# Altium schematic sheet Controller.SchDoc
size A3
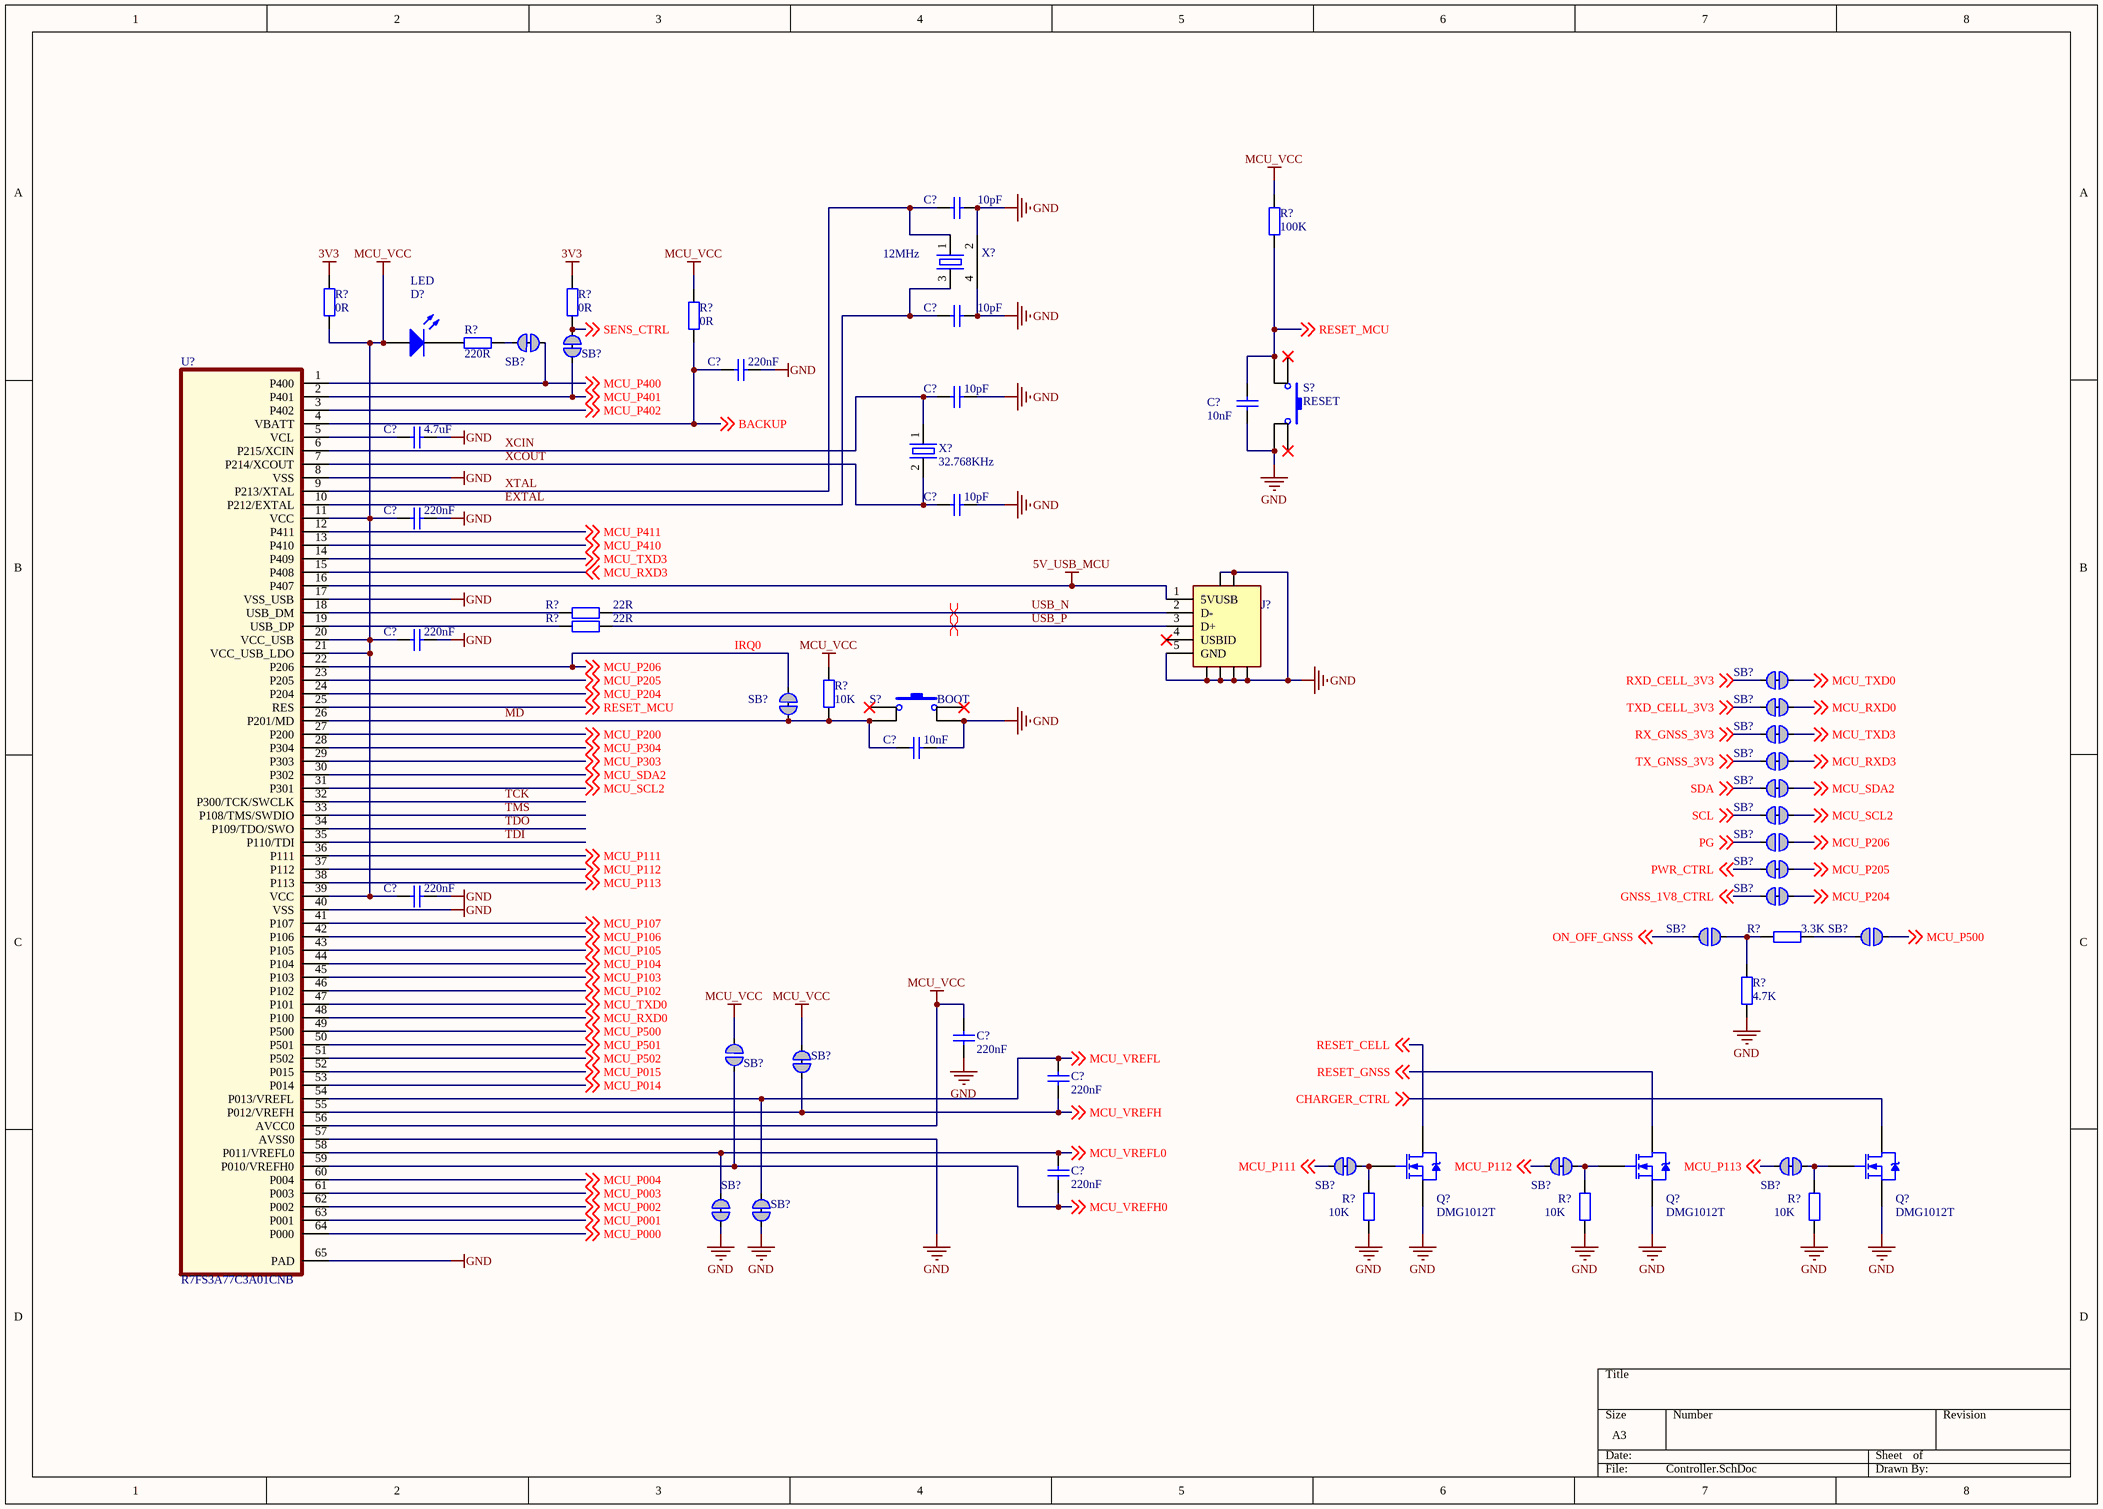
[diagram p0: Controller.SchDoc]

## Parts
(Parts that share a designator on the sheet are numbered #1, #2 ... from top to bottom, then left to right.)
C?#1  value 10pF  [C0402]  (hidden comment: Cap Semi)
C?#2  value 10pF  [C0402]  (hidden comment: Cap Semi)
C?#3  value 220nF  [C0402]  (hidden comment: Cap Semi)
C?#4  value 10pF  [C0402]  (hidden comment: Cap Semi)
C?#5  value 10nF  [C0402]  (hidden comment: Cap Semi)
C?#6  value 4.7uF  [C0402]  (hidden comment: Cap Semi)
C?#7  value 10pF  [C0402]  (hidden comment: Cap Semi)
C?#8  value 220nF  [C0402]  (hidden comment: Cap Semi)
C?#9  value 220nF  [C0402]  (hidden comment: Cap Semi)
C?#10  value 10nF  [C0402]  (hidden comment: Cap Semi)
C?#11  value 220nF  [C0402]  (hidden comment: Cap Semi)
C?#12  value 220nF  [C0402]  (hidden comment: Cap Semi)
C?#13  value 220nF  [C0402]  (hidden comment: Cap Semi)
C?#14  value 220nF  [C0402]  (hidden comment: Cap Semi)
D?  LED  [LED0805]
J?  CON-000116-01  [10103594_micro_USB]  (value not drawn)
Q?#1  DMG1012T  [SOT-523_custom]
Q?#2  DMG1012T  [SOT-523_custom]
Q?#3  DMG1012T  [SOT-523_custom]
R?#1  value 100K  [R0402]  (hidden comment: Res2)
R?#2  value 0R  [R0402]  (hidden comment: Res2)
R?#3  value 0R  [R0402]  (hidden comment: Res2)  (no BOM)
R?#4  value 220R  [R0402]  (hidden comment: Res2)
R?#5  value 0R  [R0402]  (hidden comment: Res2)
R?#6  value 22R  [R0402]  (hidden comment: Res2)
R?#7  value 22R  [R0402]  (hidden comment: Res2)
R?#8  value 10K  [R0402]  (hidden comment: Res2)
R?#9  value 3.3K  [R0402]  (hidden comment: Res2)
R?#10  value 4.7K  [R0402]  (hidden comment: Res2)
R?#11  value 10K  [R0402]  (hidden comment: Res2)
R?#12  value 10K  [R0402]  (hidden comment: Res2)
R?#13  value 10K  [R0402]  (hidden comment: Res2)
S?#1  RESET  [PTS645S_button]
S?#2  BOOT  [PTS645S_button]
SB?#1  Solderbridge  [Solderbridge_Shorted]  (value not drawn)  (net tie, no BOM)
SB?#2  Solderbridge  [Solderbridge_Shorted]  (value not drawn)  (net tie, no BOM)
SB?#3  Solderbridge  [Solderbridge_Shorted]  (value not drawn)  (net tie, no BOM)
SB?#4  Solderbridge  [Solderbridge_Shorted]  (value not drawn)  (net tie, no BOM)
SB?#5  Solderbridge  [Solderbridge_Shorted]  (value not drawn)  (net tie, no BOM)
SB?#6  Solderbridge  [Solderbridge_Shorted]  (value not drawn)  (net tie, no BOM)
SB?#7  Solderbridge  [Solderbridge_Shorted]  (value not drawn)  (net tie, no BOM)
SB?#8  Solderbridge  [Solderbridge_Shorted]  (value not drawn)  (net tie, no BOM)
SB?#9  Solderbridge  [Solderbridge_Shorted]  (value not drawn)  (net tie, no BOM)
SB?#10  Solderbridge  [Solderbridge]  (value not drawn)  (no BOM)
SB?#11  Solderbridge  [Solderbridge_Shorted]  (value not drawn)  (net tie, no BOM)
SB?#12  Solderbridge  [Solderbridge_Shorted]  (value not drawn)  (net tie, no BOM)
SB?#13  Solderbridge  [Solderbridge]  (value not drawn)  (no BOM)
SB?#14  Solderbridge  [Solderbridge]  (value not drawn)  (no BOM)
SB?#15  Solderbridge  [Solderbridge_Shorted]  (value not drawn)  (net tie, no BOM)
SB?#16  Solderbridge  [Solderbridge]  (value not drawn)  (no BOM)
SB?#17  Solderbridge  [Solderbridge_Shorted]  (value not drawn)  (net tie, no BOM)
SB?#18  Solderbridge  [Solderbridge_Shorted]  (value not drawn)  (net tie, no BOM)
SB?#19  Solderbridge  [Solderbridge_Shorted]  (value not drawn)  (net tie, no BOM)
SB?#20  Solderbridge  [Solderbridge_Shorted]  (value not drawn)  (net tie, no BOM)
SB?#21  Solderbridge  [Solderbridge_Shorted]  (value not drawn)  (net tie, no BOM)
U?  R7FS3A77C3A01CNB  [QFN-64 Renesas]
X?#1  12MHz  [XTAL_3.5x2.5]
X?#2  32.768KHz  [XTAL_3215]

## Nets
3V3: R?#2.2 R?#3.2
5V_USB_MCU: J?.1(5VUSB) U?.16(P407)
GND: C?#1.2 C?#2.1 C?#3.1 C?#4.2 C?#5.1 C?#6.1 C?#7.1 C?#8.1 C?#9.1 C?#10.2 C?#11.1 C?#12.2 J?.5(GND) J?.6 J?.7 J?.8 J?.9 J?.10 J?.11 Q?#1.3(S) Q?#2.3(S) Q?#3.3(S) R?#10.2 R?#11.1 R?#12.1 R?#13.1 S?#1.4 S?#2.4 SB?#20.1 SB?#21.1 U?.8(VSS) U?.17(VSS_USB) U?.40(VSS) U?.57(AVSS0) U?.65(PAD) X?#1.2 X?#1.4
MCU_VCC: C?#8.2 C?#9.2 C?#11.2 C?#12.1 D?.1(A) R?#1.1 R?#2.1 R?#5.2 R?#8.2 SB?#15.2 SB?#16.1 U?.11(VCC) U?.20(VCC_USB) U?.21(VCC_USB_LDO) U?.39(VCC) U?.56(AVCC0)
BACKUP: C?#3.2 R?#5.1 U?.4(VBATT) ; off-sheet BACKUP
CHARGER_CTRL: Q?#3.2(D) ; off-sheet CHARGER_CTRL
EXTAL: C?#2.2 U?.10(P212/EXTAL) X?#1.3
GNSS_1V8_CTRL: SB?#12.2 ; off-sheet GNSS_1V8_CTRL
MCU_P000: U?.64(P000) ; off-sheet MCU_P000
MCU_P001: U?.63(P001) ; off-sheet MCU_P001
MCU_P002: U?.62(P002) ; off-sheet MCU_P002
MCU_P003: U?.61(P003) ; off-sheet MCU_P003
MCU_P004: U?.60(P004) ; off-sheet MCU_P004
MCU_P014: U?.53(P014) ; off-sheet MCU_P014
MCU_P015: U?.52(P015) ; off-sheet MCU_P015
MCU_P102: U?.46(P102) ; off-sheet MCU_P102
MCU_P103: U?.45(P103) ; off-sheet MCU_P103
MCU_P104: U?.44(P104) ; off-sheet MCU_P104
MCU_P105: U?.43(P105) ; off-sheet MCU_P105
MCU_P106: U?.42(P106) ; off-sheet MCU_P106
MCU_P107: U?.41(P107) ; off-sheet MCU_P107
MCU_P111: SB?#17.2 U?.36(P111) ; off-sheet MCU_P111
MCU_P112: SB?#18.2 U?.37(P112) ; off-sheet MCU_P112
MCU_P113: SB?#19.2 U?.38(P113) ; off-sheet MCU_P113
MCU_P200: U?.27(P200) ; off-sheet MCU_P200
MCU_P204: SB?#12.1 U?.24(P204) ; off-sheet MCU_P204
MCU_P205: SB?#11.1 U?.23(P205) ; off-sheet MCU_P205
MCU_P206: SB?#5.1 SB?#10.2 U?.22(P206) ; off-sheet MCU_P206
MCU_P303: U?.29(P303) ; off-sheet MCU_P303
MCU_P304: U?.28(P304) ; off-sheet MCU_P304
MCU_P400: SB?#2.2 U?.1(P400) ; off-sheet MCU_P400
MCU_P401: SB?#1.1 U?.2(P401) ; off-sheet MCU_P401
MCU_P402: U?.3(P402) ; off-sheet MCU_P402
MCU_P410: U?.13(P410) ; off-sheet MCU_P410
MCU_P411: U?.12(P411) ; off-sheet MCU_P411
MCU_P500: SB?#14.2 U?.49(P500) ; off-sheet MCU_P500
MCU_P501: U?.50(P501) ; off-sheet MCU_P501
MCU_P502: U?.51(P502) ; off-sheet MCU_P502
MCU_RXD0: SB?#4.1 U?.48(P100) ; off-sheet MCU_RXD0
MCU_RXD3: SB?#7.1 U?.15(P408) ; off-sheet MCU_RXD3
MCU_SCL2: SB?#9.1 U?.31(P301) ; off-sheet MCU_SCL2
MCU_SDA2: SB?#8.1 U?.30(P302) ; off-sheet MCU_SDA2
MCU_TXD0: SB?#3.1 U?.47(P101) ; off-sheet MCU_TXD0
MCU_TXD3: SB?#6.1 U?.14(P409) ; off-sheet MCU_TXD3
MCU_VREFH: C?#13.1 SB?#15.1 U?.55(P012/VREFH) ; off-sheet MCU_VREFH
MCU_VREFH0: C?#14.2 SB?#16.2 U?.59(P010/VREFH0) ; off-sheet MCU_VREFH0
MCU_VREFL: C?#13.2 SB?#21.2 U?.54(P013/VREFL) ; off-sheet MCU_VREFL
MCU_VREFL0: C?#14.1 SB?#20.2 U?.58(P011/VREFL0) ; off-sheet MCU_VREFL0
MD: C?#10.1 R?#8.1 S?#2.2 SB?#5.2 U?.26(P201/MD)
ON_OFF_GNSS: SB?#13.1 ; off-sheet ON_OFF_GNSS
PG: SB?#10.1 ; off-sheet PG
PWR_CTRL: SB?#11.2 ; off-sheet PWR_CTRL
RESET_CELL: Q?#1.2(D) ; off-sheet RESET_CELL
RESET_GNSS: Q?#2.2(D) ; off-sheet RESET_GNSS
RESET_MCU: C?#5.2 R?#1.2 S?#1.2 U?.25(RES) ; off-sheet RESET_MCU
RX_GNSS_3V3: SB?#6.2 ; off-sheet RX_GNSS_3V3
RXD_CELL_3V3: SB?#3.2 ; off-sheet RXD_CELL_3V3
SCL: SB?#9.2 ; off-sheet SCL
SDA: SB?#8.2 ; off-sheet SDA
SENS_CTRL: R?#3.1 SB?#1.2 ; off-sheet SENS_CTRL
TCK: U?.32(P300/TCK/SWCLK)
TDI: U?.35(P110/TDI)
TDO: U?.34(P109/TDO/SWO)
TMS: U?.33(P108/TMS/SWDIO)
TX_GNSS_3V3: SB?#7.2 ; off-sheet TX_GNSS_3V3
TXD_CELL_3V3: SB?#4.2 ; off-sheet TXD_CELL_3V3
USB_N: J?.2(D-) R?#6.1
USB_P: J?.3(D+) R?#7.1
XCIN: C?#4.1 U?.6(P215/XCIN) X?#2.1
XCOUT: C?#7.2 U?.7(P214/XCOUT) X?#2.2
XTAL: C?#1.1 U?.9(P213/XTAL) X?#1.1
NetC?#6_2: C?#6.2 U?.5(VCL)
NetD?_2: D?.2(K) R?#4.1
NetQ?#1_1: Q?#1.1(G) R?#11.2 SB?#17.1
NetQ?#2_1: Q?#2.1(G) R?#12.2 SB?#18.1
NetQ?#3_1: Q?#3.1(G) R?#13.2 SB?#19.1
NetR?#4_2: R?#4.2 SB?#2.1
NetR?#6_2: R?#6.2 U?.18(USB_DM)
NetR?#7_2: R?#7.2 U?.19(USB_DP)
NetR?#9_1: R?#9.1 SB?#14.1
NetR?#9_2: R?#9.2 R?#10.1 SB?#13.2

Not connected (* = marked no-connect by the designer): J? 4(USBID)*; S?#1 1* 3*; S?#2 1* 3*

## Layout directives
differential pair: USB_N, USB_P

## Notes on the sheet
- IRQ0

## Library data of the parts
C?#1 C?#2 C?#4 C?#7 = Cap Semi: Capacitor (Semiconductor SIM Model); Manufacturer: YAGEO; Manufacturer Part No.: CC0402JRNPO9BN100; Part Description: Ceramic Capacitor; Specification: NP0, 6.3V, 5%; Supplier: Rutronik; Supplier part number: KKK14556; Link: https://www.rutronik24.com/product/yageo/cc0402jrnpo9bn100/29735.html
C?#3 C?#8 C?#9 C?#11-C?#14 = Cap Semi: Capacitor (Semiconductor SIM Model); Manufacturer: YAGEO; Manufacturer Part No.: CC0402KRX5R5BB224; Part Description: Ceramic Capacitor; Specification: X5R, 6.3V, 10%; Supplier: Rutronik; Supplier part number: KKK23148; Link: https://www.rutronik24.com/product/yageo/cc0402krx5r5bb224/3611951.html
C?#5 C?#10 = Cap Semi: Capacitor (Semiconductor SIM Model); Manufacturer: Samsung Electronics; Manufacturer Part No.: CL05B103KB5NNNC; Part Description: Ceramic Capacitor; Specification: X5R, 6.3V, 10%; Supplier: Rutronik; Supplier part number: KKK21418; Link: https://www.rutronik24.com/product/samsung+em/cl05b103kb5nnnc/6075254.html
C?#6 = Cap Semi: Capacitor (Semiconductor SIM Model); Manufacturer: Samsung Electronics; Manufacturer Part No.: CL05A475MQ5NRNC; Part Description: Ceramic Capacitor; Specification: X5R, 6.3V, 20%; Supplier: Rutronik; Supplier part number: KKS1042; Link: https://www.rutronik24.com/product/samsung+em/cl05a475mq5nrnc/4333694.html
D? = LED2: Typical SMD LED; Manufacturer: LITE ON; Manufacturer Part No.: LTST-C170KGKT; Specification: Green, 20mA; Value: LTST-C170KGKT; Supplier: Rutronik; Supplier part number: LED7323; Part Description: Typical SMD LED; Link: https://www.rutronik24.com/product/liteon/ltst-c170kgkt/33908.html
J? = CON-000116-01: Manufacturer: FCI; Manufacturer Part No.: 10103594-0001LF; Part Description: SMD Micro USB Connector; Specification: Type B; Value: 10103594-0001LF; Supplier: Rutronik; Supplier part number: CONIO1038; Link: https://www.rutronik24.com/product/amph+icc/10103594-0001lf/1536675.html
Q?#1-Q?#3 = NMOS-2: N-Channel Power MOSFET; Manufacturer: Diodes Inc.; Manufacturer Part No.: DMG1012T-7; Part Description: N-Channel MOSFET; Specification: 20V, 0.63A; Value: DMG1012T-7; Supplier: Rutronik; Supplier part number: TMOSS6623; Link: https://www.rutronik24.com/product/diodes+inc/dmg1012t-7/5168665.html
R?#1 = Res2: Manufacturer: ASJ; Manufacturer Part No.: CR10-104-JK; Part Description: Thick Film Resistor; Specification: 5% 0,063W; Supplier: Rutronik; Supplier part number: WRC34858; Link: https://www.rutronik24.com/product/asj/cr10-104-jk/51752.html
R?#2 R?#3 R?#5 = Res2: Manufacturer: YAGEO; Manufacturer Part No.: RC0402FR-070RL; Part Description: Thick Film Resistor; Specification: 5% 0,063W; Supplier: Rutronik; Supplier part number: WRC53079; Link: https://www.rutronik24.com/product/yageo/rc0402fr-070rl/5183530.html
R?#4 = Res2: Manufacturer: ASJ; Manufacturer Part No.: CR10-221-JK; Part Description: Thick Film Resistor; Specification: 5% 0,063W; Supplier: Rutronik; Supplier part number: WRC35108; Link: https://www.rutronik24.com/product/asj/cr10-221-jk/51883.html
R?#6 R?#7 = Res2: Manufacturer: ASJ; Manufacturer Part No.: CR10-220-JK; Part Description: Thick Film Resistor; Specification: 5% 0,063W; Supplier: Rutronik; Supplier part number: WRC34862; Link: https://www.rutronik24.com/product/asj/cr10-220-jk/51754.html
R?#8 R?#11-R?#13 = Res2: Manufacturer: ASJ; Manufacturer Part No.: CR10-103-JK; Part Description: Thick Film Resistor; Specification: 5% 0,063W; Supplier: Rutronik; Supplier part number: WRC40976; Link: https://www.rutronik24.com/product/asj/cr10-103-jk/54295.html
R?#9 = Res2: Manufacturer: YAGEO; Manufacturer Part No.: RC0402JR-073K3L; Part Description: Thick Film Resistor; Specification: 5% 0,063W; Supplier: Rutronik; Supplier part number: WRC33843; Link: https://www.rutronik24.com/product/yageo/rc0402jr-073k3l/51012.html
R?#10 = Res2: Manufacturer: ASJ; Manufacturer Part No.: CR10-472-JK; Part Description: Thick Film Resistor; Specification: 5% 0,063W; Supplier: Rutronik; Supplier part number: WRC41427; Link: https://www.rutronik24.com/product/asj/cr10-472-jk/54393.html
S?#1 S?#2 = SW-PB: Switch; Manufacturer: C&K; Manufacturer Part No.: PTS645SM43SMTR92 LFS; Part Description: Tactile Button; Specification: 1.6N, Straight, SMT; Value: PTS645SM43SMTR92 LFS; Supplier: Rutronik; Supplier part number: SWITCH8818; Link: https://www.rutronik24.com/product/c%26k/pts645sm43smtr92+lfs/3580965.html
SB?#1-SB?#9 SB?#11 SB?#12 SB?#15 SB?#17-SB?#21 = Solderbridge Shorted: Manufacturer: *; Value: Solderbridge; Supplier: *; Supplier part number: *
U? = R7FS3A77C3A01CNB: 48-MHz Arm®, Cortex®-M4, 1-MB Flash,  192-KB SRAM; Manufacturer: Renesas; Part Description: 48MHz Cortex®-M4, 1-MB FLASH,  192-KB SRAM; Specification: 48MHz, 5.5V; Manufacturer Part No.: R7FS3A77C3A01CNB; Supplier: Rutronik; Supplier part number: ICMCU24303; Value: R7FS3A77C3A01CNB; Link: https://www.rutronik24.com/product/renesas/r7fs3a77c3a01cnb%23ac1/8039220.html
X?#1 = XTL-000011-01: Manufacturer: Epson Electronics; Manufacturer Part No.: FA-238V 12,000000M 12pF 50ppm; Part Description: XTAL 3.2x2.5mm; Specification: 12MHz, 12pF, 50ppm; Value: FA-238V 12,000000M 12pF 50ppm; Supplier: Rutronik; Supplier part number: QUARZ2498; Link: https://www.rutronik24.com/product/epson/fa-238v+12%2C000000m++12pf+50ppm++rohsconf/35285.html
X?#2 = XTL-000011-01: Manufacturer: Epson Electronics; Manufacturer Part No.: FC-135 32.7680KA-AC3; Part Description: XTAL 3.2x1.5mm; Specification: 32.768 kHz, 9pF, 20ppm; Value: FC-135 32.7680KA-AC3; Supplier: Rutronik; Supplier part number: QUARZ6279; Link: https://www.rutronik24.com/product/epson/fc-135r+32%2C768khz++9pf++20ppm+++rohsconf/5825395.html
SB?#10 SB?#13 SB?#14 SB?#16 = Solderbridge: Manufacturer: *; Value: Solderbridge; Supplier: *; Supplier part number: *